# Altium schematic sheet keyboard.SchDoc
size A0; DocumentNumber: 1; SheetNumber: 1; SheetTotal: 1
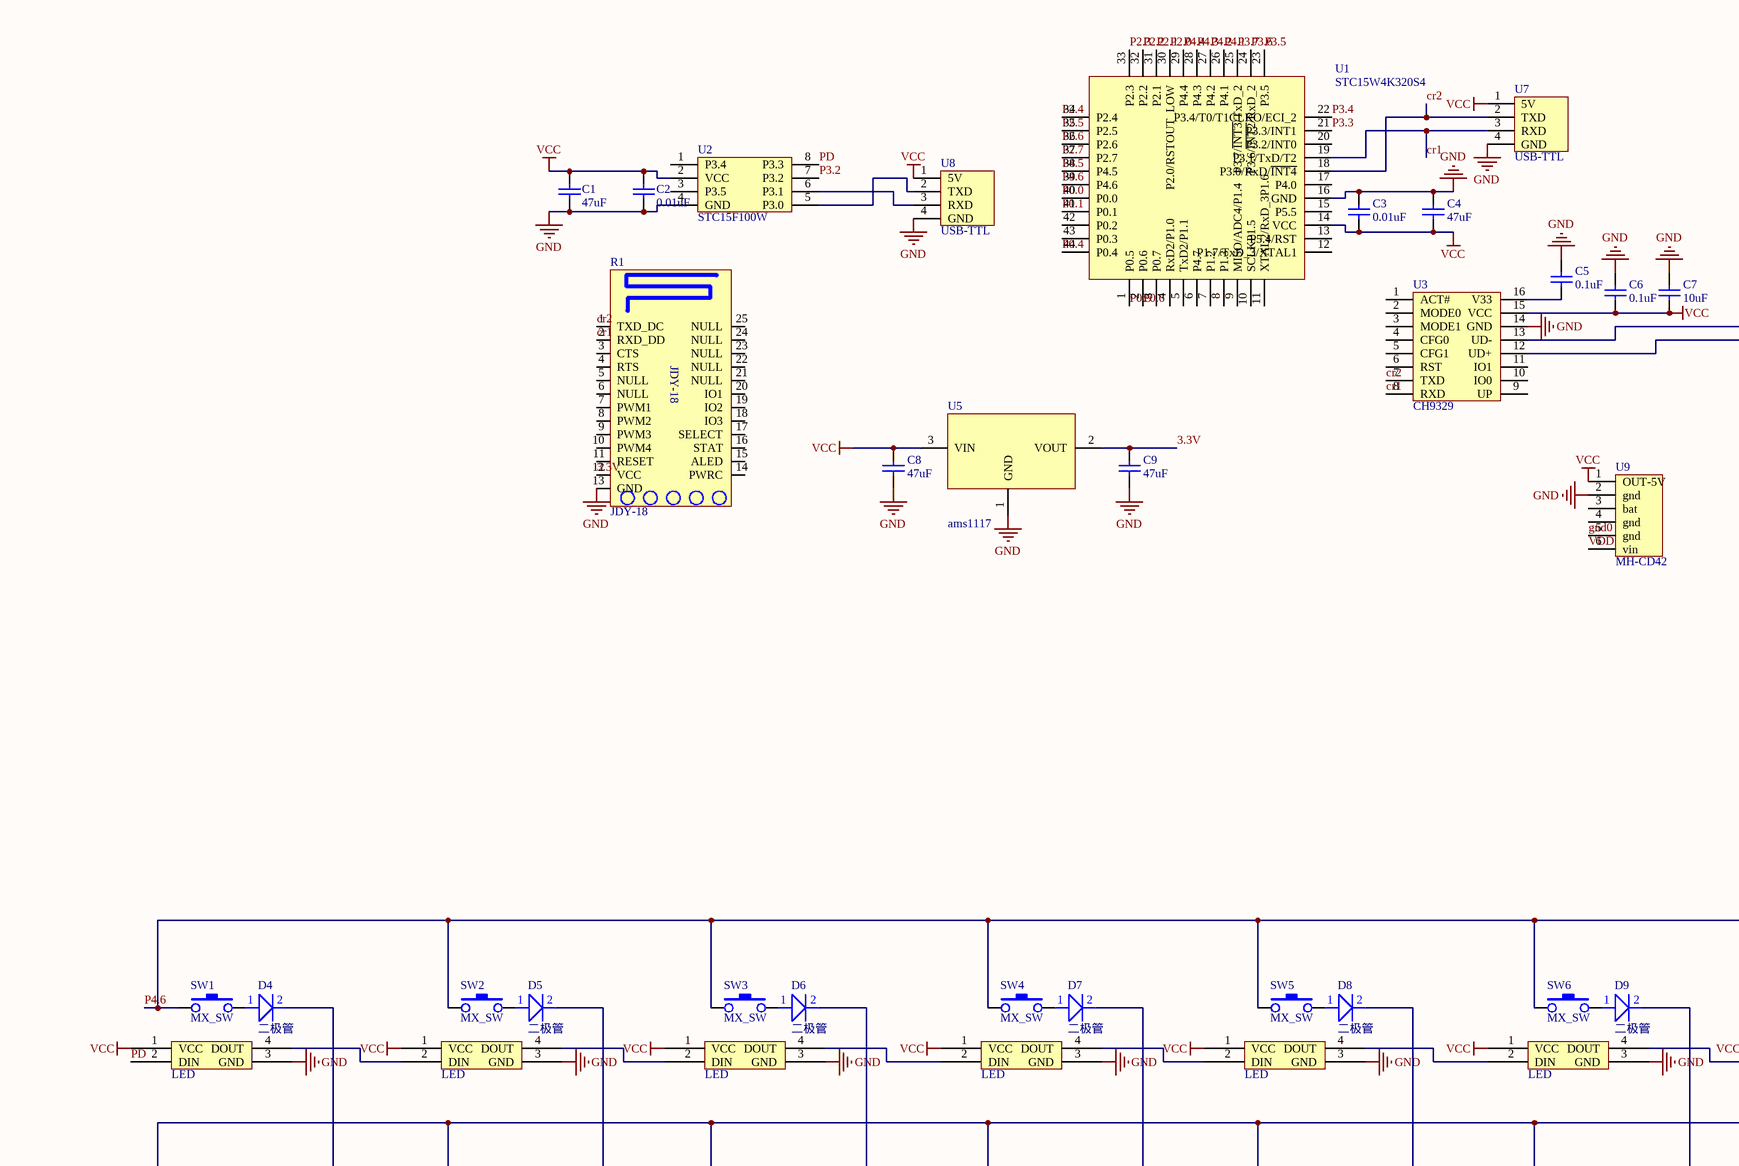
[diagram p0: keyboard.SchDoc, top left]
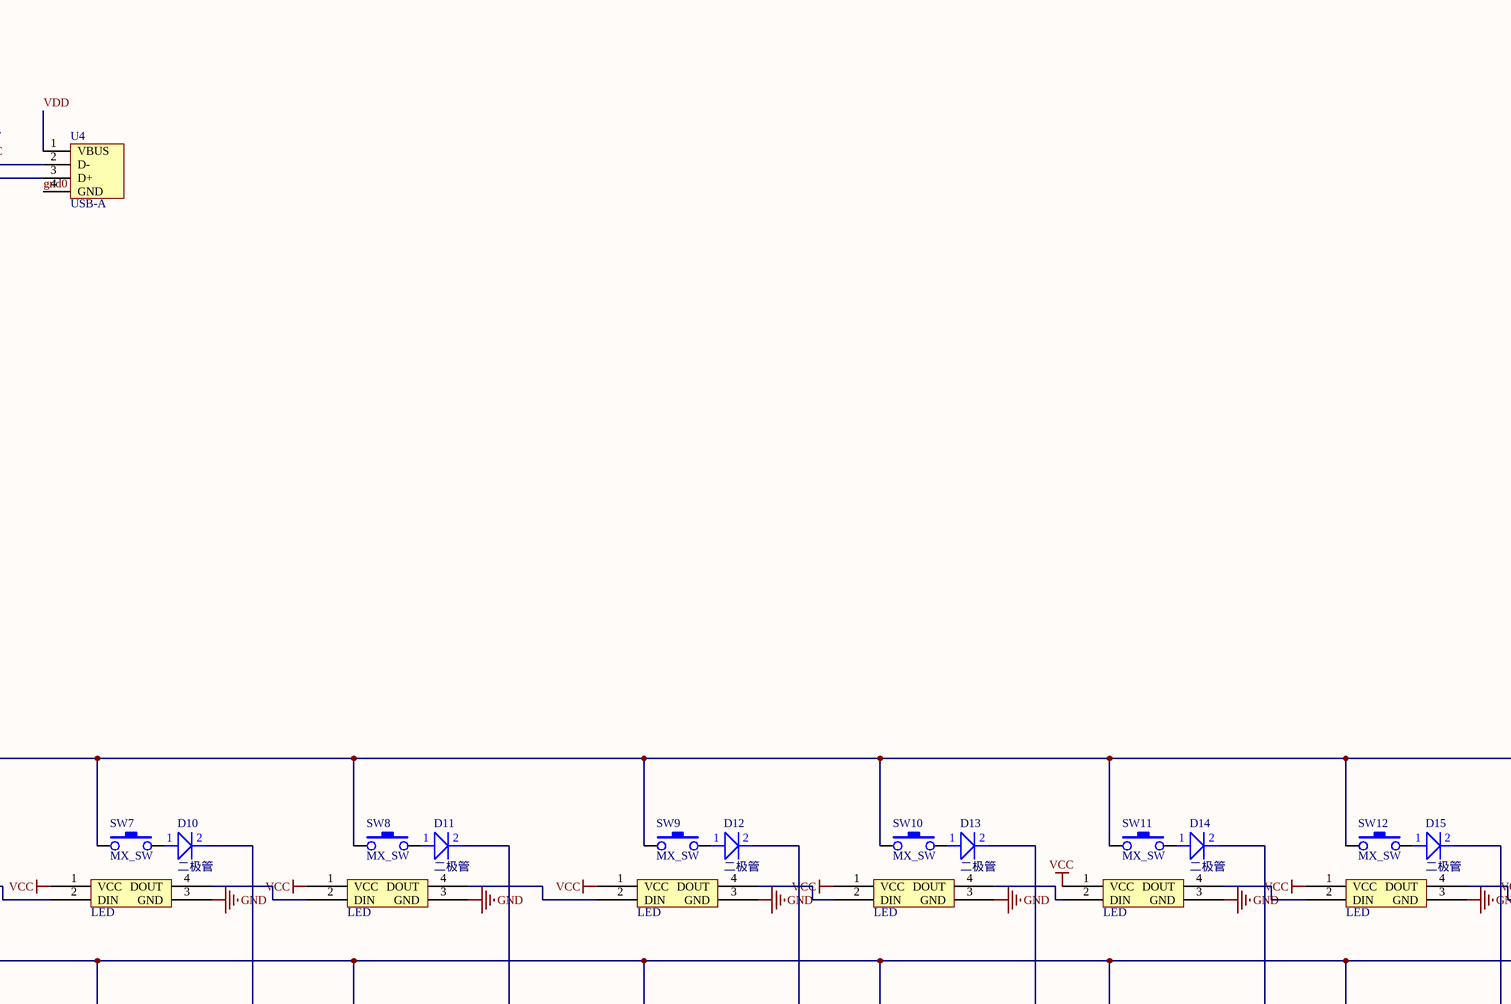
[diagram p1: keyboard.SchDoc, top middle]
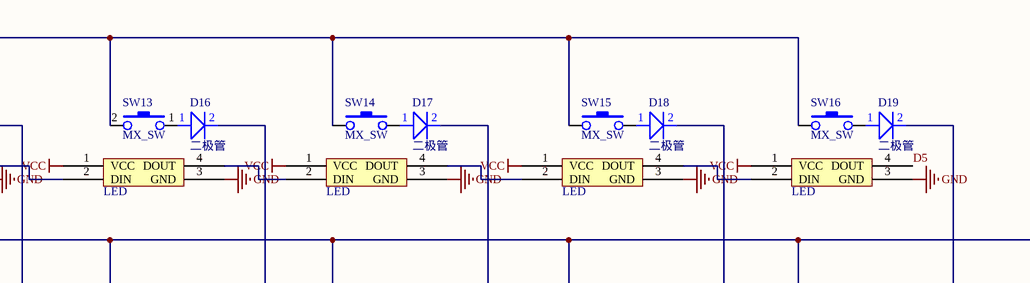
[diagram p2: keyboard.SchDoc, top right]
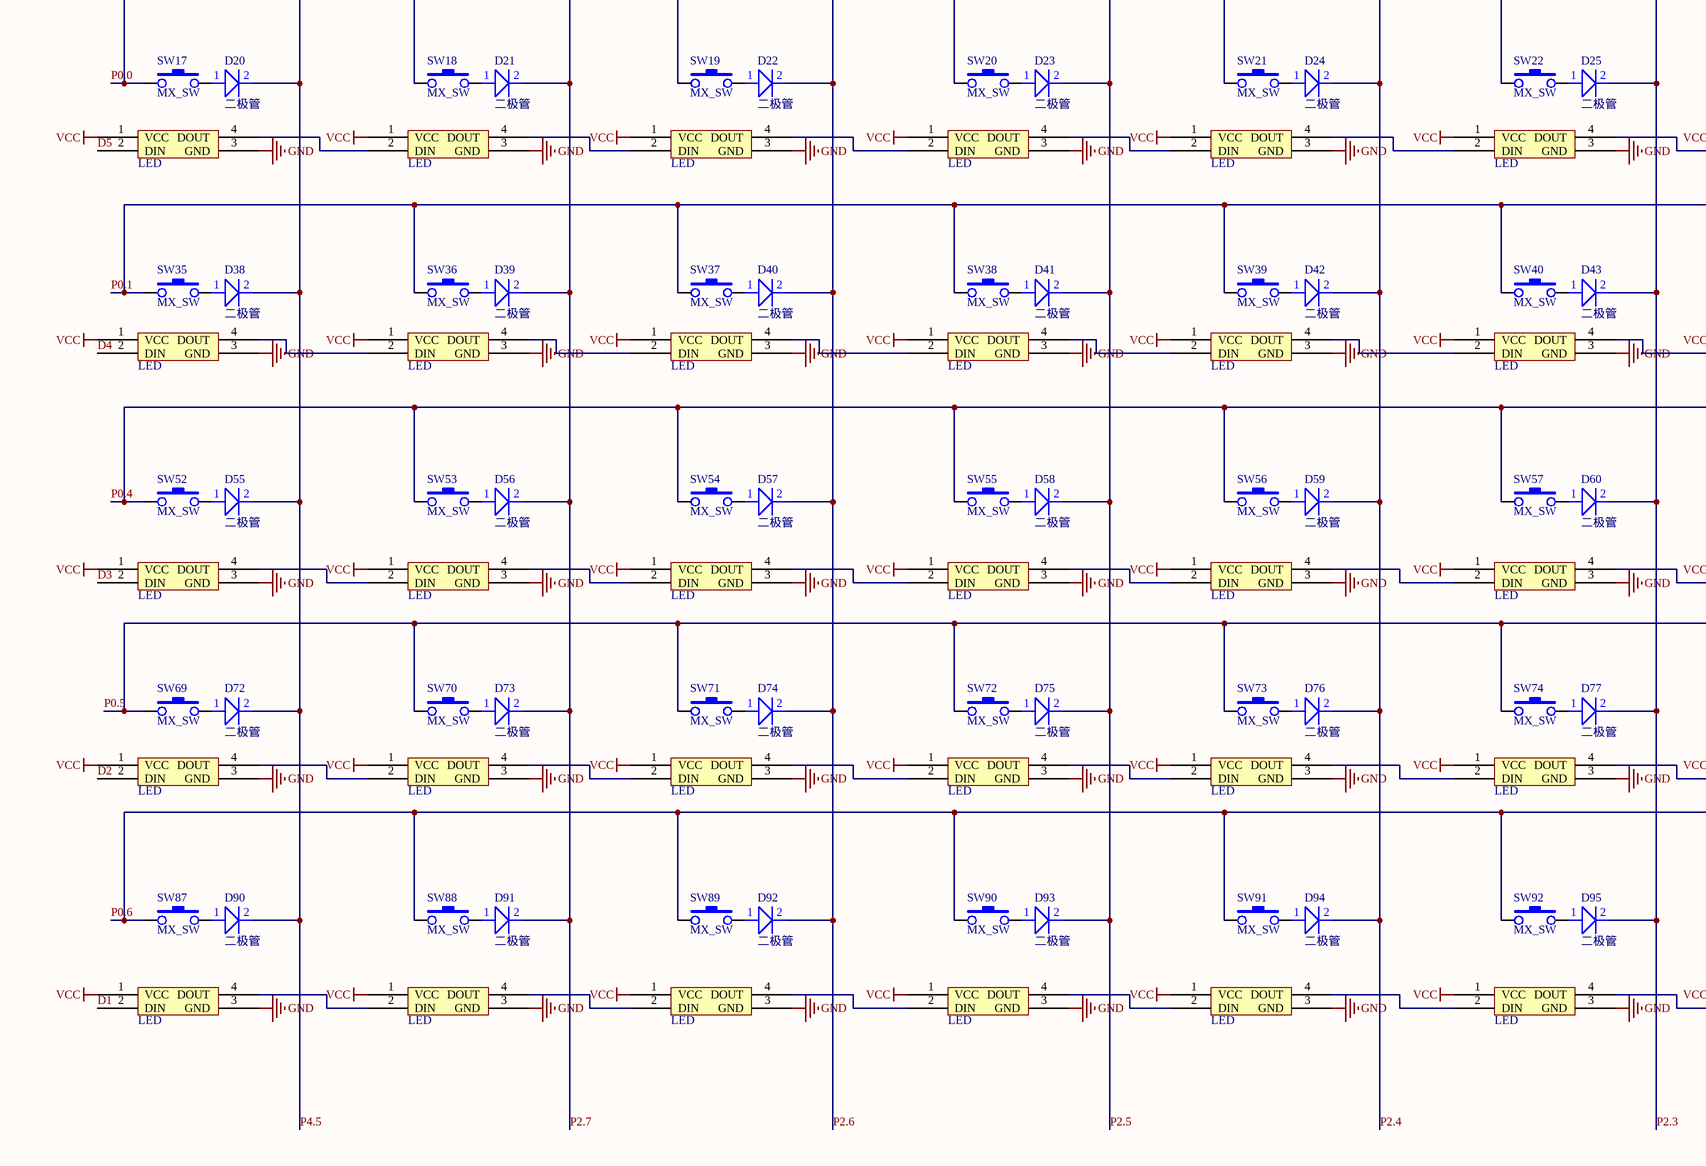
[diagram p3: keyboard.SchDoc, bottom left]
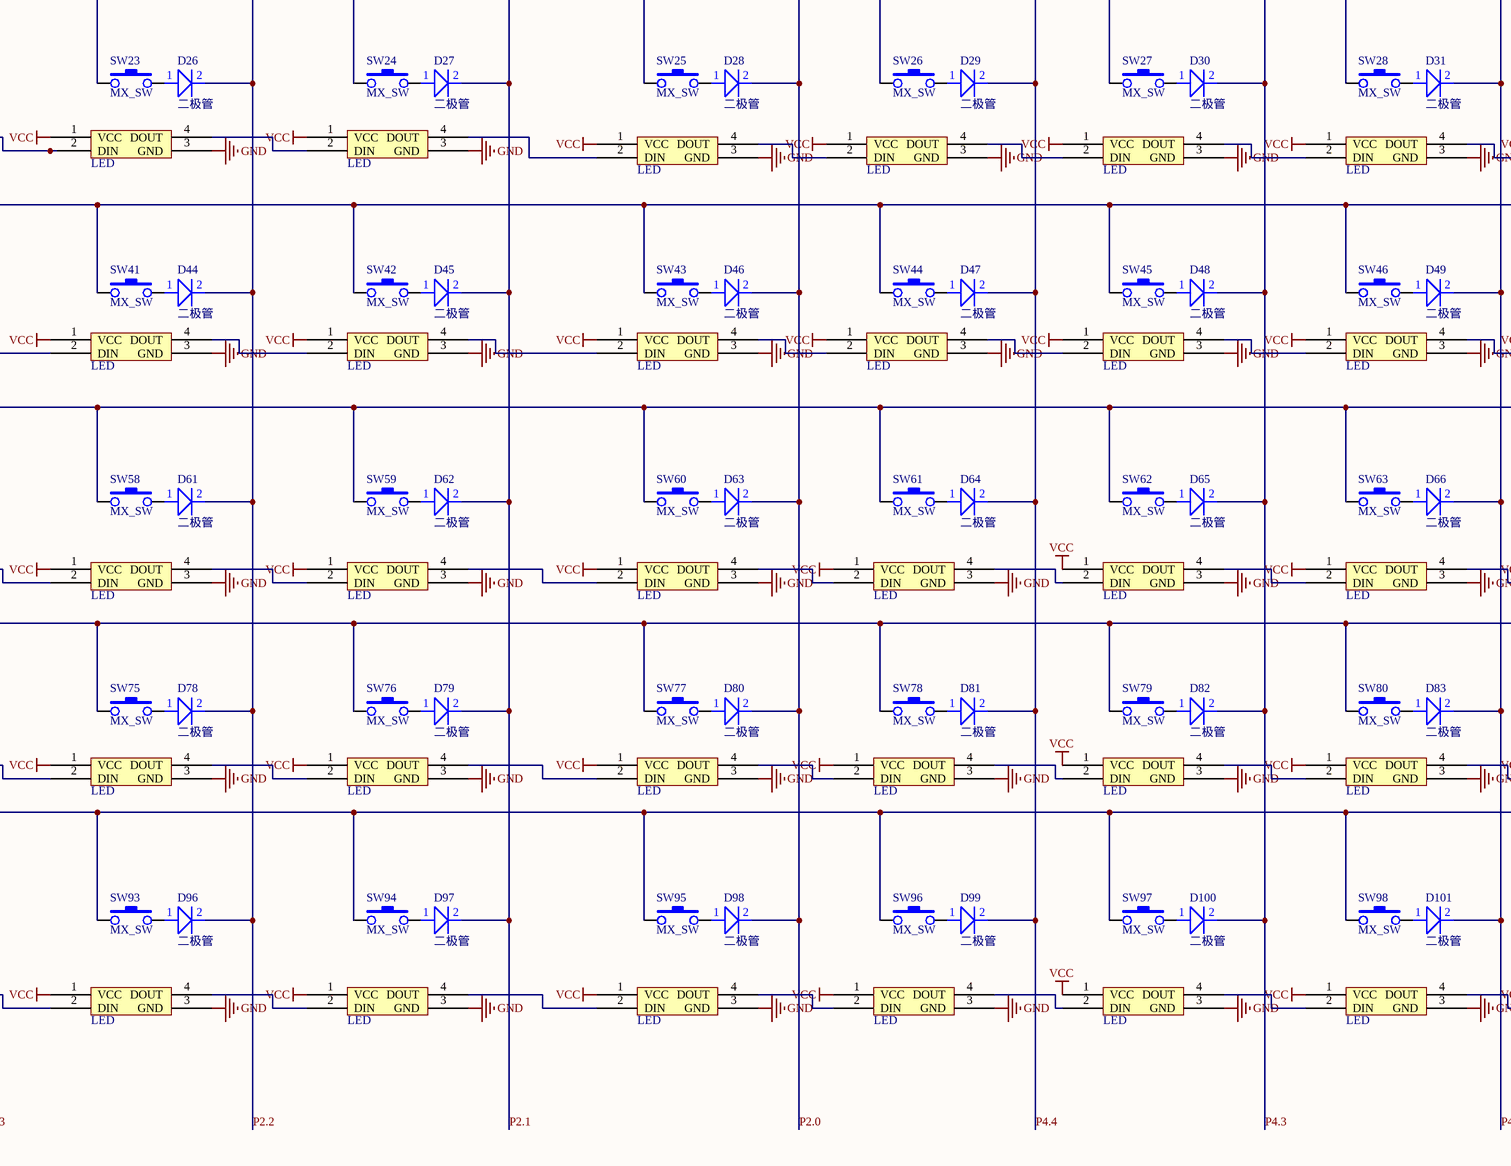
[diagram p4: keyboard.SchDoc, bottom middle]
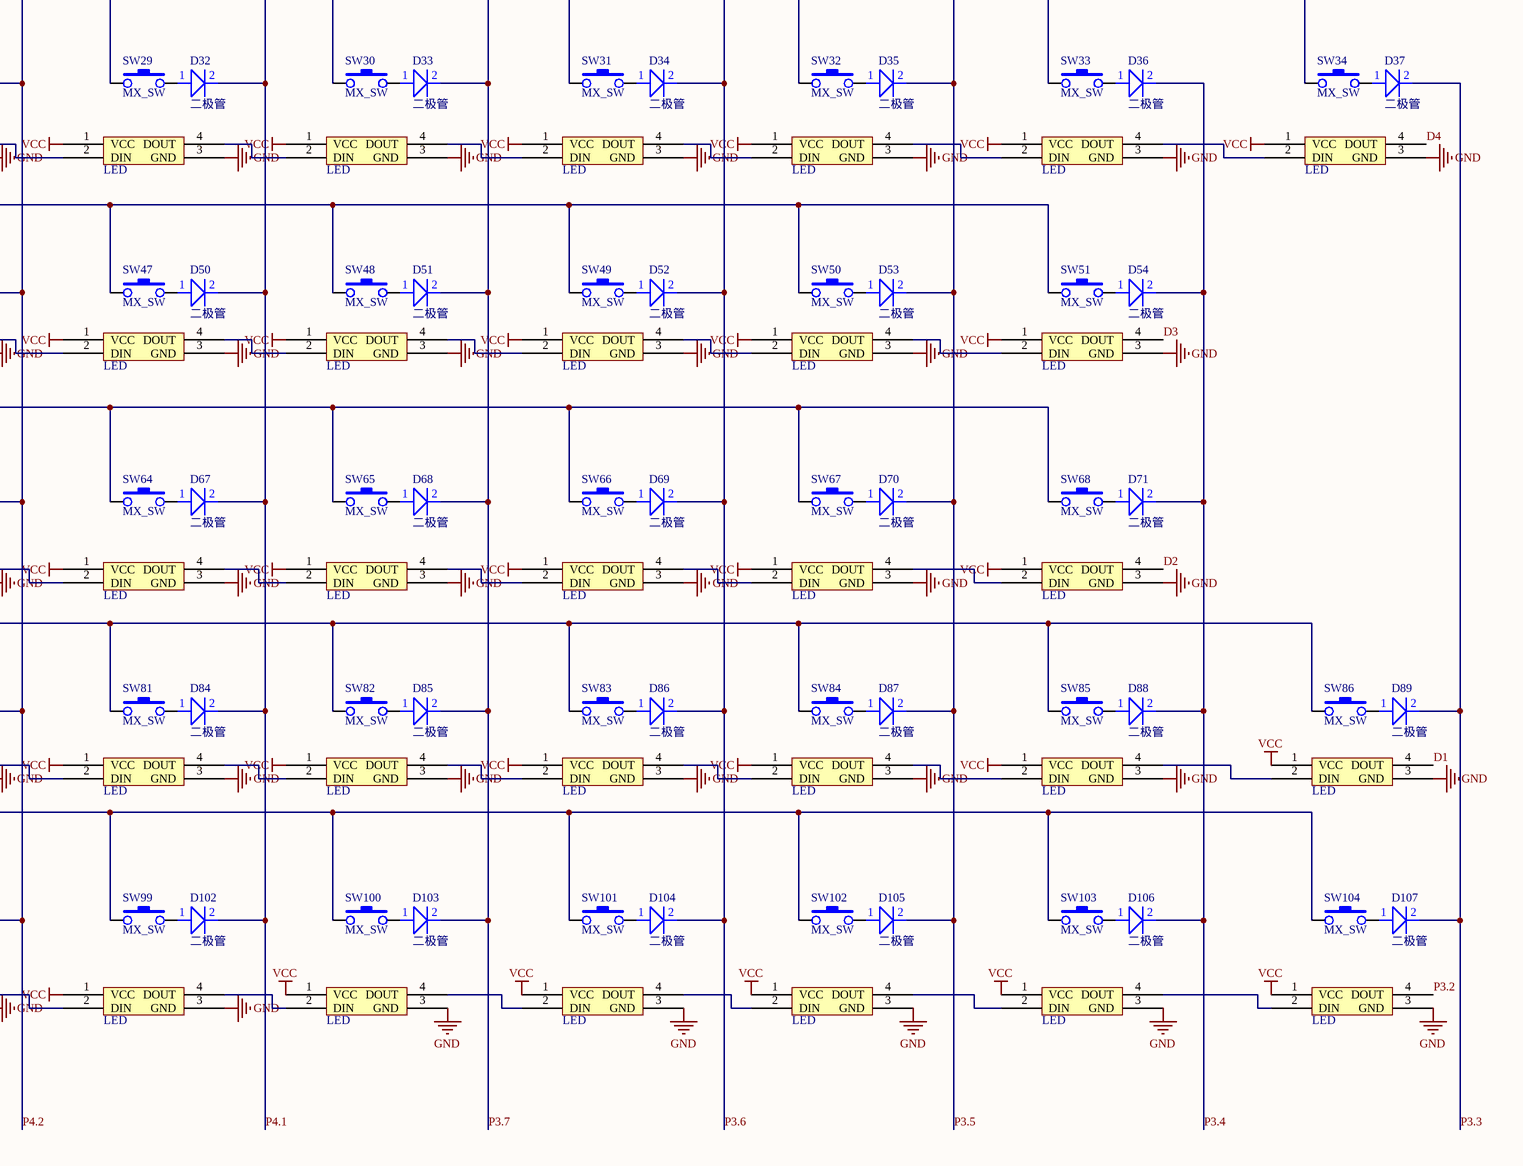
[diagram p5: keyboard.SchDoc, bottom right]

## Parts
*1  LED  [6028]
*2  LED  [6028]
*3  LED  [6028]
*4  LED  [6028]
*5  LED  [6028]
*6  LED  [6028]
*7  LED  [6028]
*8  LED  [6028]
*9  LED  [6028]
*10  LED  [6028]
*11  LED  [6028]
*12  LED  [6028]
*13  LED  [6028]
*14  LED  [6028]
*15  LED  [6028]
*16  LED  [6028]
*17  LED  [6028]
*18  LED  [6028]
*19  LED  [6028]
*20  LED  [6028]
*21  LED  [6028]
*22  LED  [6028]
*23  LED  [6028]
*24  LED  [6028]
*25  LED  [6028]
*26  LED  [6028]
*27  LED  [6028]
*28  LED  [6028]
*29  LED  [6028]
*30  LED  [6028]
*31  LED  [6028]
*32  LED  [6028]
*33  LED  [6028]
*34  LED  [6028]
*35  LED  [6028]
*36  LED  [6028]
*37  LED  [6028]
*38  LED  [6028]
*39  LED  [6028]
*40  LED  [6028]
*41  LED  [6028]
*42  LED  [6028]
*43  LED  [6028]
*44  LED  [6028]
*45  LED  [6028]
*46  LED  [6028]
*47  LED  [6028]
*48  LED  [6028]
*49  LED  [6028]
*50  LED  [6028]
*51  LED  [6028]
*52  LED  [6028]
*53  LED  [6028]
*54  LED  [6028]
*55  LED  [6028]
*56  LED  [6028]
*57  LED  [6028]
*58  LED  [6028]
*59  LED  [6028]
*60  LED  [6028]
*61  LED  [6028]
*62  LED  [6028]
*63  LED  [6028]
*64  LED  [6028]
*65  LED  [6028]
*66  LED  [6028]
*67  LED  [6028]
*68  LED  [6028]
*69  LED  [6028]
*70  LED  [6028]
*71  LED  [6028]
*72  LED  [6028]
*73  LED  [6028]
*74  LED  [6028]
*75  LED  [6028]
*76  LED  [6028]
*77  LED  [6028]
*78  LED  [6028]
*79  LED  [6028]
*80  LED  [6028]
*81  LED  [6028]
*82  LED  [6028]
*83  LED  [6028]
*84  LED  [6028]
*85  LED  [6028]
*86  LED  [6028]
*87  LED  [6028]
*88  LED  [6028]
*89  LED  [6028]
*90  LED  [6028]
*91  LED  [6028]
*92  LED  [6028]
*93  LED  [6028]
*94  LED  [6028]
*95  LED  [6028]
*96  LED  [6028]
*97  LED  [6028]
*98  LED  [6028]
*99  LED  [6028]
*100  LED  [6028]
*101  LED  [6028]
*102  LED  [6028]
*103  LED  [6028]
*104  LED  [6028]
C1  value 47uF  [C 0805_M]  (hidden comment: C_0603)
C2  value 0.01uF  [C 0805_M]  (hidden comment: C_0603)
C3  value 0.01uF  [C 0805_M]  (hidden comment: C_0603)
C4  value 47uF  [C 0805_M]  (hidden comment: C_0603)
C5  value 0.1uF  [C 0805_M]  (hidden comment: C_0603)
C6  value 0.1uF  [C 0805_M]  (hidden comment: C_0603)
C7  value 10uF  [C 0805_M]  (hidden comment: C_0603)
C8  value 47uF  [C 0805_M]  (hidden comment: C_0603)
C9  value 47uF  [C 0805_M]  (hidden comment: C_0603)
D4  二极管  [LL-34]
D5  二极管  [LL-34]
D6  二极管  [LL-34]
D7  二极管  [LL-34]
D8  二极管  [LL-34]
D9  二极管  [LL-34]
D10  二极管  [LL-34]
D11  二极管  [LL-34]
D12  二极管  [LL-34]
D13  二极管  [LL-34]
D14  二极管  [LL-34]
D15  二极管  [LL-34]
D16  二极管  [LL-34]
D17  二极管  [LL-34]
D18  二极管  [LL-34]
D19  二极管  [LL-34]
D20  二极管  [LL-34]
D21  二极管  [LL-34]
D22  二极管  [LL-34]
D23  二极管  [LL-34]
D24  二极管  [LL-34]
D25  二极管  [LL-34]
D26  二极管  [LL-34]
D27  二极管  [LL-34]
D28  二极管  [LL-34]
D29  二极管  [LL-34]
D30  二极管  [LL-34]
D31  二极管  [LL-34]
D32  二极管  [LL-34]
D33  二极管  [LL-34]
D34  二极管  [LL-34]
D35  二极管  [LL-34]
D36  二极管  [LL-34]
D37  二极管  [LL-34]
D38  二极管  [LL-34]
D39  二极管  [LL-34]
D40  二极管  [LL-34]
D41  二极管  [LL-34]
D42  二极管  [LL-34]
D43  二极管  [LL-34]
D44  二极管  [LL-34]
D45  二极管  [LL-34]
D46  二极管  [LL-34]
D47  二极管  [LL-34]
D48  二极管  [LL-34]
D49  二极管  [LL-34]
D50  二极管  [LL-34]
D51  二极管  [LL-34]
D52  二极管  [LL-34]
D53  二极管  [LL-34]
D54  二极管  [LL-34]
D55  二极管  [LL-34]
D56  二极管  [LL-34]
D57  二极管  [LL-34]
D58  二极管  [LL-34]
D59  二极管  [LL-34]
D60  二极管  [LL-34]
D61  二极管  [LL-34]
D62  二极管  [LL-34]
D63  二极管  [LL-34]
D64  二极管  [LL-34]
D65  二极管  [LL-34]
D66  二极管  [LL-34]
D67  二极管  [LL-34]
D68  二极管  [LL-34]
D69  二极管  [LL-34]
D70  二极管  [LL-34]
D71  二极管  [LL-34]
D72  二极管  [LL-34]
D73  二极管  [LL-34]
D74  二极管  [LL-34]
D75  二极管  [LL-34]
D76  二极管  [LL-34]
D77  二极管  [LL-34]
D78  二极管  [LL-34]
D79  二极管  [LL-34]
D80  二极管  [LL-34]
D81  二极管  [LL-34]
D82  二极管  [LL-34]
D83  二极管  [LL-34]
D84  二极管  [LL-34]
D85  二极管  [LL-34]
D86  二极管  [LL-34]
D87  二极管  [LL-34]
D88  二极管  [LL-34]
D89  二极管  [LL-34]
D90  二极管  [LL-34]
D91  二极管  [LL-34]
D92  二极管  [LL-34]
D93  二极管  [LL-34]
D94  二极管  [LL-34]
D95  二极管  [LL-34]
D96  二极管  [LL-34]
D97  二极管  [LL-34]
D98  二极管  [LL-34]
D99  二极管  [LL-34]
D100  二极管  [LL-34]
D101  二极管  [LL-34]
D102  二极管  [LL-34]
D103  二极管  [LL-34]
D104  二极管  [LL-34]
D105  二极管  [LL-34]
D106  二极管  [LL-34]
D107  二极管  [LL-34]
R1  JDY-18  [JDY-18]
SW1  MX_SW  [MX_SW-4]
SW2  MX_SW  [MX_SW-4]
SW3  MX_SW  [MX_SW-4]
SW4  MX_SW  [MX_SW-4]
SW5  MX_SW  [MX_SW-4]
SW6  MX_SW  [MX_SW-4]
SW7  MX_SW  [MX_SW-4]
SW8  MX_SW  [MX_SW-4]
SW9  MX_SW  [MX_SW-4]
SW10  MX_SW  [MX_SW-4]
SW11  MX_SW  [MX_SW-4]
SW12  MX_SW  [MX_SW-4]
SW13  MX_SW  [MX_SW-4]
SW14  MX_SW  [MX_SW-4]
SW15  MX_SW  [MX_SW-4]
SW16  MX_SW  [MX_SW-4]
SW17  MX_SW  [MX_SW-4]
SW18  MX_SW  [MX_SW-4]
SW19  MX_SW  [MX_SW-4]
SW20  MX_SW  [MX_SW-4]
SW21  MX_SW  [MX_SW-4]
SW22  MX_SW  [MX_SW-4]
SW23  MX_SW  [MX_SW-4]
SW24  MX_SW  [MX_SW-4]
SW25  MX_SW  [MX_SW-4]
SW26  MX_SW  [MX_SW-4]
SW27  MX_SW  [MX_SW-4]
SW28  MX_SW  [MX_SW-4]
SW29  MX_SW  [MX_SW-4]
SW30  MX_SW  [MX_SW-4]
SW31  MX_SW  [MX_SW-4]
SW32  MX_SW  [MX_SW-4]
SW33  MX_SW  [MX_SW-4]
SW34  MX_SW  [MX_SW-4]
SW35  MX_SW  [MX_SW-4]
SW36  MX_SW  [MX_SW-4]
SW37  MX_SW  [MX_SW-4]
SW38  MX_SW  [MX_SW-4]
SW39  MX_SW  [MX_SW-4]
SW40  MX_SW  [MX_SW-4]
SW41  MX_SW  [MX_SW-4]
SW42  MX_SW  [MX_SW-4]
SW43  MX_SW  [MX_SW-4]
SW44  MX_SW  [MX_SW-4]
SW45  MX_SW  [MX_SW-4]
SW46  MX_SW  [MX_SW-4]
SW47  MX_SW  [MX_SW-4]
SW48  MX_SW  [MX_SW-4]
SW49  MX_SW  [MX_SW-4]
SW50  MX_SW  [MX_SW-4]
SW51  MX_SW  [MX_SW-4]
SW52  MX_SW  [MX_SW-4]
SW53  MX_SW  [MX_SW-4]
SW54  MX_SW  [MX_SW-4]
SW55  MX_SW  [MX_SW-4]
SW56  MX_SW  [MX_SW-4]
SW57  MX_SW  [MX_SW-4]
SW58  MX_SW  [MX_SW-4]
SW59  MX_SW  [MX_SW-4]
SW60  MX_SW  [MX_SW-4]
SW61  MX_SW  [MX_SW-4]
SW62  MX_SW  [MX_SW-4]
SW63  MX_SW  [MX_SW-4]
SW64  MX_SW  [MX_SW-4]
SW65  MX_SW  [MX_SW-4]
SW66  MX_SW  [MX_SW-4]
SW67  MX_SW  [MX_SW-4]
SW68  MX_SW  [MX_SW-4]
SW69  MX_SW  [MX_SW-4]
SW70  MX_SW  [MX_SW-4]
SW71  MX_SW  [MX_SW-4]
SW72  MX_SW  [MX_SW-4]
SW73  MX_SW  [MX_SW-4]
SW74  MX_SW  [MX_SW-4]
SW75  MX_SW  [MX_SW-4]
SW76  MX_SW  [MX_SW-4]
SW77  MX_SW  [MX_SW-4]
SW78  MX_SW  [MX_SW-4]
SW79  MX_SW  [MX_SW-4]
SW80  MX_SW  [MX_SW-4]
SW81  MX_SW  [MX_SW-4]
SW82  MX_SW  [MX_SW-4]
SW83  MX_SW  [MX_SW-4]
SW84  MX_SW  [MX_SW-4]
SW85  MX_SW  [MX_SW-4]
SW86  MX_SW  [MX_SW-4]
SW87  MX_SW  [MX_SW-4]
SW88  MX_SW  [MX_SW-4]
SW89  MX_SW  [MX_SW-4]
SW90  MX_SW  [MX_SW-4]
SW91  MX_SW  [MX_SW-4]
SW92  MX_SW  [MX_SW-4]
SW93  MX_SW  [MX_SW-4]
SW94  MX_SW  [MX_SW-4]
SW95  MX_SW  [MX_SW-4]
SW96  MX_SW  [MX_SW-4]
SW97  MX_SW  [MX_SW-4]
SW98  MX_SW  [MX_SW-4]
SW99  MX_SW  [MX_SW-4]
SW100  MX_SW  [MX_SW-4]
SW101  MX_SW  [MX_SW-4]
SW102  MX_SW  [MX_SW-4]
SW103  MX_SW  [MX_SW-4]
SW104  MX_SW  [MX_SW-4]
U1  STC15W4K320S4  [LQFP44 10X10_M]
U2  STC15F100W  [SOIC-8]
U3  CH9329  [SOP16]
U4  USB-A  [usb a]
U5  ams1117  [SOT223_N]
U7  USB-TTL  [4pin排针]
U8  USB-TTL  [4pin排针]
U9  MH-CD42  [MH-CD42]

## Nets
GND: *1.3(GND) *2.3(GND) *3.3(GND) *4.3(GND) *5.3(GND) *6.3(GND) *7.3(GND) *8.3(GND) *9.3(GND) *10.3(GND) *11.3(GND) *12.3(GND) *13.3(GND) *14.3(GND) *15.3(GND) *16.3(GND) *17.3(GND) *18.3(GND) *19.3(GND) *20.3(GND) *21.3(GND) *22.3(GND) *23.3(GND) *24.3(GND) *25.3(GND) *26.3(GND) *27.3(GND) *28.3(GND) *29.3(GND) *30.3(GND) *31.3(GND) *32.3(GND) *33.3(GND) *34.3(GND) *35.3(GND) *36.3(GND) *37.3(GND) *38.3(GND) *39.3(GND) *40.3(GND) *41.3(GND) *42.3(GND) *43.3(GND) *44.3(GND) *45.3(GND) *46.3(GND) *47.3(GND) *48.3(GND) *49.3(GND) *50.3(GND) *51.3(GND) *52.3(GND) *53.3(GND) *54.3(GND) *55.3(GND) *56.3(GND) *57.3(GND) *58.3(GND) *59.3(GND) *60.3(GND) *61.3(GND) *62.3(GND) *63.3(GND) *64.3(GND) *65.3(GND) *66.3(GND) *67.3(GND) *68.3(GND) *69.3(GND) *70.3(GND) *71.3(GND) *72.3(GND) *73.3(GND) *74.3(GND) *75.3(GND) *76.3(GND) *77.3(GND) *78.3(GND) *79.3(GND) *80.3(GND) *81.3(GND) *82.3(GND) *83.3(GND) *84.3(GND) *85.3(GND) *86.3(GND) *87.3(GND) *88.3(GND) *89.3(GND) *90.3(GND) *91.3(GND) *92.3(GND) *93.3(GND) *94.3(GND) *95.3(GND) *96.3(GND) *97.3(GND) *98.3(GND) *99.3(GND) *100.3(GND) *101.3(GND) *102.3(GND) *103.3(GND) *104.3(GND) C1.1 C2.1 C3.1 C4.1 C5.1 C6.1 C7.1 C8.2 C9.2 R1.13(GND) U1.16(GND) U2.4(GND) U3.14(GND) U5.1(GND) U7.4(GND) U8.4(GND) U9.2(gnd)
VCC: *1.1(VCC) *2.1(VCC) *3.1(VCC) *4.1(VCC) *5.1(VCC) *6.1(VCC) *7.1(VCC) *8.1(VCC) *9.1(VCC) *10.1(VCC) *11.1(VCC) *12.1(VCC) *13.1(VCC) *14.1(VCC) *15.1(VCC) *16.1(VCC) *17.1(VCC) *18.1(VCC) *19.1(VCC) *20.1(VCC) *21.1(VCC) *22.1(VCC) *23.1(VCC) *24.1(VCC) *25.1(VCC) *26.1(VCC) *27.1(VCC) *28.1(VCC) *29.1(VCC) *30.1(VCC) *31.1(VCC) *32.1(VCC) *33.1(VCC) *34.1(VCC) *35.1(VCC) *36.1(VCC) *37.1(VCC) *38.1(VCC) *39.1(VCC) *40.1(VCC) *41.1(VCC) *42.1(VCC) *43.1(VCC) *44.1(VCC) *45.1(VCC) *46.1(VCC) *47.1(VCC) *48.1(VCC) *49.1(VCC) *50.1(VCC) *51.1(VCC) *52.1(VCC) *53.1(VCC) *54.1(VCC) *55.1(VCC) *56.1(VCC) *57.1(VCC) *58.1(VCC) *59.1(VCC) *60.1(VCC) *61.1(VCC) *62.1(VCC) *63.1(VCC) *64.1(VCC) *65.1(VCC) *66.1(VCC) *67.1(VCC) *68.1(VCC) *69.1(VCC) *70.1(VCC) *71.1(VCC) *72.1(VCC) *73.1(VCC) *74.1(VCC) *75.1(VCC) *76.1(VCC) *77.1(VCC) *78.1(VCC) *79.1(VCC) *80.1(VCC) *81.1(VCC) *82.1(VCC) *83.1(VCC) *84.1(VCC) *85.1(VCC) *86.1(VCC) *87.1(VCC) *88.1(VCC) *89.1(VCC) *90.1(VCC) *91.1(VCC) *92.1(VCC) *93.1(VCC) *94.1(VCC) *95.1(VCC) *96.1(VCC) *97.1(VCC) *98.1(VCC) *99.1(VCC) *100.1(VCC) *101.1(VCC) *102.1(VCC) *103.1(VCC) *104.1(VCC) C1.2 C2.2 C3.2 C4.2 C6.2 C7.2 C8.1 U1.14(VCC) U2.2(VCC) U3.15(VCC) U5.3(VIN) U7.1(5V) U8.1(5V) U9.1(OUT-5V)
3.3V: C9.1 R1.12(VCC) U5.2(VOUT)
cr1: R1.2(RXD_DD) U1.19(P3.1/TxD/T2) U3.8(RXD) U7.3(RXD)
cr2: R1.1(TXD_DC) U1.18(P3.0/RxD/~{INT4}) U3.7(TXD) U7.2(TXD)
D1: *86.4(DOUT) *87.2(DIN)
D2: *68.4(DOUT) *69.2(DIN)
D3: *51.4(DOUT) *52.2(DIN)
D4: *34.4(DOUT) *35.2(DIN)
D5: *16.4(DOUT) *17.2(DIN)
gnd0: U4.4(GND) U9.5(gnd)
P0.0: SW17.2 SW18.2 SW19.2 SW20.2 SW21.2 SW22.2 SW23.2 SW24.2 SW25.2 SW26.2 SW27.2 SW28.2 SW29.2 SW30.2 SW31.2 SW32.2 SW33.2 SW34.2 U1.40(P0.0)
P0.1: SW35.2 SW36.2 SW37.2 SW38.2 SW39.2 SW40.2 SW41.2 SW42.2 SW43.2 SW44.2 SW45.2 SW46.2 SW47.2 SW48.2 SW49.2 SW50.2 SW51.2 U1.41(P0.1)
P0.4: SW52.2 SW53.2 SW54.2 SW55.2 SW56.2 SW57.2 SW58.2 SW59.2 SW60.2 SW61.2 SW62.2 SW63.2 SW64.2 SW65.2 SW66.2 SW67.2 SW68.2 U1.44(P0.4)
P0.5: SW69.2 SW70.2 SW71.2 SW72.2 SW73.2 SW74.2 SW75.2 SW76.2 SW77.2 SW78.2 SW79.2 SW80.2 SW81.2 SW82.2 SW83.2 SW84.2 SW85.2 SW86.2 U1.1(P0.5)
P0.6: SW87.2 SW88.2 SW89.2 SW90.2 SW91.2 SW92.2 SW93.2 SW94.2 SW95.2 SW96.2 SW97.2 SW98.2 SW99.2 SW100.2 SW101.2 SW102.2 SW103.2 SW104.2 U1.2(P0.6)
P2.0: D12.2 D28.2 D46.2 D63.2 D80.2 D98.2 U1.30(P2.0/RSTOUT_LOW)
P2.1: D11.2 D27.2 D45.2 D62.2 D79.2 D97.2 U1.31(P2.1)
P2.2: D10.2 D26.2 D44.2 D61.2 D78.2 D96.2 U1.32(P2.2)
P2.3: D9.2 D25.2 D43.2 D60.2 D77.2 D95.2 U1.33(P2.3)
P2.4: D8.2 D24.2 D42.2 D59.2 D76.2 D94.2 U1.34(P2.4)
P2.5: D7.2 D23.2 D41.2 D58.2 D75.2 D93.2 U1.35(P2.5)
P2.6: D6.2 D22.2 D40.2 D57.2 D74.2 D92.2 U1.36(P2.6)
P2.7: D5.2 D21.2 D39.2 D56.2 D73.2 D91.2 U1.37(P2.7)
P3.2: *104.4(DOUT) U2.7(P3.2)
P3.3: D37.2 D89.2 D107.2 U1.21(P3.3/INT1)
P3.4: D36.2 D54.2 D71.2 D88.2 D106.2 U1.22(P3.4/T0/T1CLKO/ECI_2)
P3.5: D19.2 D35.2 D53.2 D70.2 D87.2 D105.2 U1.23(P3.5)
P3.6: D18.2 D34.2 D52.2 D69.2 D86.2 D104.2 U1.24(P3.6/~{INT2}/RxD_2)
P3.7: D17.2 D33.2 D51.2 D68.2 D85.2 D103.2 U1.25(P3.7/~{INT3}/TxD_2)
P4.1: D16.2 D32.2 D50.2 D67.2 D84.2 D102.2 U1.26(P4.1)
P4.2: D15.2 D31.2 D49.2 D66.2 D83.2 D101.2 U1.27(P4.2)
P4.3: D14.2 D30.2 D48.2 D65.2 D82.2 D100.2 U1.28(P4.3)
P4.4: D13.2 D29.2 D47.2 D64.2 D81.2 D99.2 U1.29(P4.4)
P4.5: D4.2 D20.2 D38.2 D55.2 D72.2 D90.2 U1.38(P4.5)
P4.6: SW1.2 SW2.2 SW3.2 SW4.2 SW5.2 SW6.2 SW7.2 SW8.2 SW9.2 SW10.2 SW11.2 SW12.2 SW13.2 SW14.2 SW15.2 SW16.2 U1.39(P4.6)
PD: *1.2(DIN) U2.8(P3.3)
VDD: U4.1(VBUS) U9.6(vin)
Net*1_4: *1.4(DOUT) *2.2(DIN)
Net*2_4: *2.4(DOUT) *3.2(DIN)
Net*3_4: *3.4(DOUT) *4.2(DIN)
Net*4_4: *4.4(DOUT) *5.2(DIN)
Net*5_4: *5.4(DOUT) *6.2(DIN)
Net*6_4: *6.4(DOUT) *7.2(DIN)
Net*7_4: *7.4(DOUT) *8.2(DIN)
Net*8_4: *8.4(DOUT) *9.2(DIN)
Net*9_4: *9.4(DOUT) *10.2(DIN)
Net*10_4: *10.4(DOUT) *11.2(DIN)
Net*11_4: *11.4(DOUT) *12.2(DIN)
Net*12_4: *12.4(DOUT) *13.2(DIN)
Net*13_4: *13.4(DOUT) *14.2(DIN)
Net*14_4: *14.4(DOUT) *15.2(DIN)
Net*15_4: *15.4(DOUT) *16.2(DIN)
Net*17_4: *17.4(DOUT) *18.2(DIN)
Net*18_4: *18.4(DOUT) *19.2(DIN)
Net*19_4: *19.4(DOUT) *20.2(DIN)
Net*20_4: *20.4(DOUT) *21.2(DIN)
Net*21_4: *21.4(DOUT) *22.2(DIN)
Net*22_4: *22.4(DOUT) *23.2(DIN)
Net*23_4: *23.4(DOUT) *24.2(DIN)
Net*24_4: *24.4(DOUT) *25.2(DIN)
Net*25_4: *25.4(DOUT) *26.2(DIN)
Net*26_4: *26.4(DOUT) *27.2(DIN)
Net*27_4: *27.4(DOUT) *28.2(DIN)
Net*28_4: *28.4(DOUT) *29.2(DIN)
Net*29_4: *29.4(DOUT) *30.2(DIN)
Net*30_4: *30.4(DOUT) *31.2(DIN)
Net*31_4: *31.4(DOUT) *32.2(DIN)
Net*32_4: *32.4(DOUT) *33.2(DIN)
Net*33_4: *33.4(DOUT) *34.2(DIN)
Net*35_4: *35.4(DOUT) *36.2(DIN)
Net*36_4: *36.4(DOUT) *37.2(DIN)
Net*37_4: *37.4(DOUT) *38.2(DIN)
Net*38_4: *38.4(DOUT) *39.2(DIN)
Net*39_4: *39.4(DOUT) *40.2(DIN)
Net*40_4: *40.4(DOUT) *41.2(DIN)
Net*41_4: *41.4(DOUT) *42.2(DIN)
Net*42_4: *42.4(DOUT) *43.2(DIN)
Net*43_4: *43.4(DOUT) *44.2(DIN)
Net*44_4: *44.4(DOUT) *45.2(DIN)
Net*45_4: *45.4(DOUT) *46.2(DIN)
Net*46_4: *46.4(DOUT) *47.2(DIN)
Net*47_4: *47.4(DOUT) *48.2(DIN)
Net*48_4: *48.4(DOUT) *49.2(DIN)
Net*49_4: *49.4(DOUT) *50.2(DIN)
Net*50_4: *50.4(DOUT) *51.2(DIN)
Net*52_4: *52.4(DOUT) *53.2(DIN)
Net*53_4: *53.4(DOUT) *54.2(DIN)
Net*54_4: *54.4(DOUT) *55.2(DIN)
Net*55_4: *55.4(DOUT) *56.2(DIN)
Net*56_4: *56.4(DOUT) *57.2(DIN)
Net*57_4: *57.4(DOUT) *58.2(DIN)
Net*58_4: *58.4(DOUT) *59.2(DIN)
Net*59_4: *59.4(DOUT) *60.2(DIN)
Net*60_4: *60.4(DOUT) *61.2(DIN)
Net*61_4: *61.4(DOUT) *62.2(DIN)
Net*62_4: *62.4(DOUT) *63.2(DIN)
Net*63_4: *63.4(DOUT) *64.2(DIN)
Net*64_4: *64.4(DOUT) *65.2(DIN)
Net*65_4: *65.4(DOUT) *66.2(DIN)
Net*66_4: *66.4(DOUT) *67.2(DIN)
Net*67_4: *67.4(DOUT) *68.2(DIN)
Net*69_4: *69.4(DOUT) *70.2(DIN)
Net*70_4: *70.4(DOUT) *71.2(DIN)
Net*71_4: *71.4(DOUT) *72.2(DIN)
Net*72_4: *72.4(DOUT) *73.2(DIN)
Net*73_4: *73.4(DOUT) *74.2(DIN)
Net*74_4: *74.4(DOUT) *75.2(DIN)
Net*75_4: *75.4(DOUT) *76.2(DIN)
Net*76_4: *76.4(DOUT) *77.2(DIN)
Net*77_4: *77.4(DOUT) *78.2(DIN)
Net*78_4: *78.4(DOUT) *79.2(DIN)
Net*79_4: *79.4(DOUT) *80.2(DIN)
Net*80_4: *80.4(DOUT) *81.2(DIN)
Net*81_4: *81.4(DOUT) *82.2(DIN)
Net*82_4: *82.4(DOUT) *83.2(DIN)
Net*83_4: *83.4(DOUT) *84.2(DIN)
Net*84_4: *84.4(DOUT) *85.2(DIN)
Net*85_4: *85.4(DOUT) *86.2(DIN)
Net*87_4: *87.4(DOUT) *88.2(DIN)
Net*88_4: *88.4(DOUT) *89.2(DIN)
Net*89_4: *89.4(DOUT) *90.2(DIN)
Net*90_4: *90.4(DOUT) *91.2(DIN)
Net*91_4: *91.4(DOUT) *92.2(DIN)
Net*92_4: *92.4(DOUT) *93.2(DIN)
Net*93_4: *93.4(DOUT) *94.2(DIN)
Net*94_4: *94.4(DOUT) *95.2(DIN)
Net*95_4: *95.4(DOUT) *96.2(DIN)
Net*96_4: *96.4(DOUT) *97.2(DIN)
Net*97_4: *97.4(DOUT) *98.2(DIN)
Net*98_4: *98.4(DOUT) *99.2(DIN)
Net*99_4: *99.4(DOUT) *100.2(DIN)
Net*100_4: *100.4(DOUT) *101.2(DIN)
Net*101_4: *101.4(DOUT) *102.2(DIN)
Net*102_4: *102.4(DOUT) *103.2(DIN)
Net*103_4: *103.4(DOUT) *104.2(DIN)
NetC5_2: C5.2 U3.16(V33)
NetD4_1: D4.1 SW1.1
NetD5_1: D5.1 SW2.1
NetD6_1: D6.1 SW3.1
NetD7_1: D7.1 SW4.1
NetD8_1: D8.1 SW5.1
NetD9_1: D9.1 SW6.1
NetD10_1: D10.1 SW7.1
NetD11_1: D11.1 SW8.1
NetD12_1: D12.1 SW9.1
NetD13_1: D13.1 SW10.1
NetD14_1: D14.1 SW11.1
NetD15_1: D15.1 SW12.1
NetD16_1: D16.1 SW13.1
NetD17_1: D17.1 SW14.1
NetD18_1: D18.1 SW15.1
NetD19_1: D19.1 SW16.1
NetD20_1: D20.1 SW17.1
NetD21_1: D21.1 SW18.1
NetD22_1: D22.1 SW19.1
NetD23_1: D23.1 SW20.1
NetD24_1: D24.1 SW21.1
NetD25_1: D25.1 SW22.1
NetD26_1: D26.1 SW23.1
NetD27_1: D27.1 SW24.1
NetD28_1: D28.1 SW25.1
NetD29_1: D29.1 SW26.1
NetD30_1: D30.1 SW27.1
NetD31_1: D31.1 SW28.1
NetD32_1: D32.1 SW29.1
NetD33_1: D33.1 SW30.1
NetD34_1: D34.1 SW31.1
NetD35_1: D35.1 SW32.1
NetD36_1: D36.1 SW33.1
NetD37_1: D37.1 SW34.1
NetD38_1: D38.1 SW35.1
NetD39_1: D39.1 SW36.1
NetD40_1: D40.1 SW37.1
NetD41_1: D41.1 SW38.1
NetD42_1: D42.1 SW39.1
NetD43_1: D43.1 SW40.1
NetD44_1: D44.1 SW41.1
NetD45_1: D45.1 SW42.1
NetD46_1: D46.1 SW43.1
NetD47_1: D47.1 SW44.1
NetD48_1: D48.1 SW45.1
NetD49_1: D49.1 SW46.1
NetD50_1: D50.1 SW47.1
NetD51_1: D51.1 SW48.1
NetD52_1: D52.1 SW49.1
NetD53_1: D53.1 SW50.1
NetD54_1: D54.1 SW51.1
NetD55_1: D55.1 SW52.1
NetD56_1: D56.1 SW53.1
NetD57_1: D57.1 SW54.1
NetD58_1: D58.1 SW55.1
NetD59_1: D59.1 SW56.1
NetD60_1: D60.1 SW57.1
NetD61_1: D61.1 SW58.1
NetD62_1: D62.1 SW59.1
NetD63_1: D63.1 SW60.1
NetD64_1: D64.1 SW61.1
NetD65_1: D65.1 SW62.1
NetD66_1: D66.1 SW63.1
NetD67_1: D67.1 SW64.1
NetD68_1: D68.1 SW65.1
NetD69_1: D69.1 SW66.1
NetD70_1: D70.1 SW67.1
NetD71_1: D71.1 SW68.1
NetD72_1: D72.1 SW69.1
NetD73_1: D73.1 SW70.1
NetD74_1: D74.1 SW71.1
NetD75_1: D75.1 SW72.1
NetD76_1: D76.1 SW73.1
NetD77_1: D77.1 SW74.1
NetD78_1: D78.1 SW75.1
NetD79_1: D79.1 SW76.1
NetD80_1: D80.1 SW77.1
NetD81_1: D81.1 SW78.1
NetD82_1: D82.1 SW79.1
NetD83_1: D83.1 SW80.1
NetD84_1: D84.1 SW81.1
NetD85_1: D85.1 SW82.1
NetD86_1: D86.1 SW83.1
NetD87_1: D87.1 SW84.1
NetD88_1: D88.1 SW85.1
NetD89_1: D89.1 SW86.1
NetD90_1: D90.1 SW87.1
NetD91_1: D91.1 SW88.1
NetD92_1: D92.1 SW89.1
NetD93_1: D93.1 SW90.1
NetD94_1: D94.1 SW91.1
NetD95_1: D95.1 SW92.1
NetD96_1: D96.1 SW93.1
NetD97_1: D97.1 SW94.1
NetD98_1: D98.1 SW95.1
NetD99_1: D99.1 SW96.1
NetD100_1: D100.1 SW97.1
NetD101_1: D101.1 SW98.1
NetD102_1: D102.1 SW99.1
NetD103_1: D103.1 SW100.1
NetD104_1: D104.1 SW101.1
NetD105_1: D105.1 SW102.1
NetD106_1: D106.1 SW103.1
NetD107_1: D107.1 SW104.1
NetU2_5: U2.5(P3.0) U8.2(TXD)
NetU2_6: U2.6(P3.1) U8.3(RXD)
NetU3_12: U3.12(UD+) U4.3(D+)
NetU3_13: U3.13(UD-) U4.2(D-)

Not connected (* = marked no-connect by the designer): R1 3(CTS) 4(RTS) 5(NULL) 6(NULL) 7(PWM1) 8(PWM2) 9(PWM3) 10(PWM4) 11(RESET) 14(PWRC) 15(ALED) 16(STAT) 17(SELECT) 18(IO3) 19(IO2) 20(IO1) 21(NULL) 22(NULL) 23(NULL) 24(NULL) 25(NULL); U1 3(P0.7) 4(RxD2/P1.0) 5(TxD2/P1.1) 6(P4.7) 7(P1.2) 8(P1.3) 9(MISO/ADC4/P1.4) 10(SCLKP1.5) 11(XTAL2/RxD_3P1.6) 12(P1.7/TxD_3/XTAL1) 13(P5.4/RST) 15(P5.5) 17(P4.0) 20(P3.2/INT0) 42(P0.2) 43(P0.3); U2 1(P3.4) 3(P3.5); U3 1(ACT#) 2(MODE0) 3(MODE1) 4(CFG0) 5(CFG1) 6(RST) 9(UP) 10(IO0) 11(IO1); U9 3(bat) 4(gnd)

## Library data of the parts
*1-*104 = 3512led
D4-D107 = LL4148
SW1-SW104 = MX_SW-4: with Fixation pins  1-Pole
U1 = STC15F2K60S2: IC芯片
U4 = USB-MICRO
U7 U8 = BLUETOOTH
C1-C9 = C_0603: Published: 8-Jun-2000; LatestRevisionDate: 17-Jul-2002; LatestRevisionNote: Re-released for DXP Platform.; PackageReference: RAD-0.3; Publisher: Altium Limited; PackageDescription: Radial Cap, Thru-Hole; 2 Leads; 0.3 in Pin Spacing